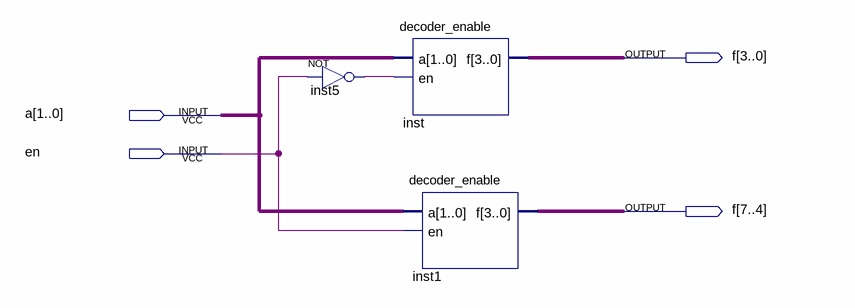
[diagram p0: schematic sheet]
// Quartus schematic Block.bdf as structural Verilog: 3 symbols, 4 pins
module Block (
  input  [1:0] a,
  input  en,
  output [7:0] f
);

  wire inst5_out;

  not inst5 (inst5_out, en);
  decoder_enable inst (.a(a), .en(inst5_out), .f(f[3:0]));
  decoder_enable inst1 (.a(a), .en(en), .f(f[7:4]));
endmodule
